# EAGLE design EscapeRoom_Shield_Mega_Master (EAGLE 9.6.2)
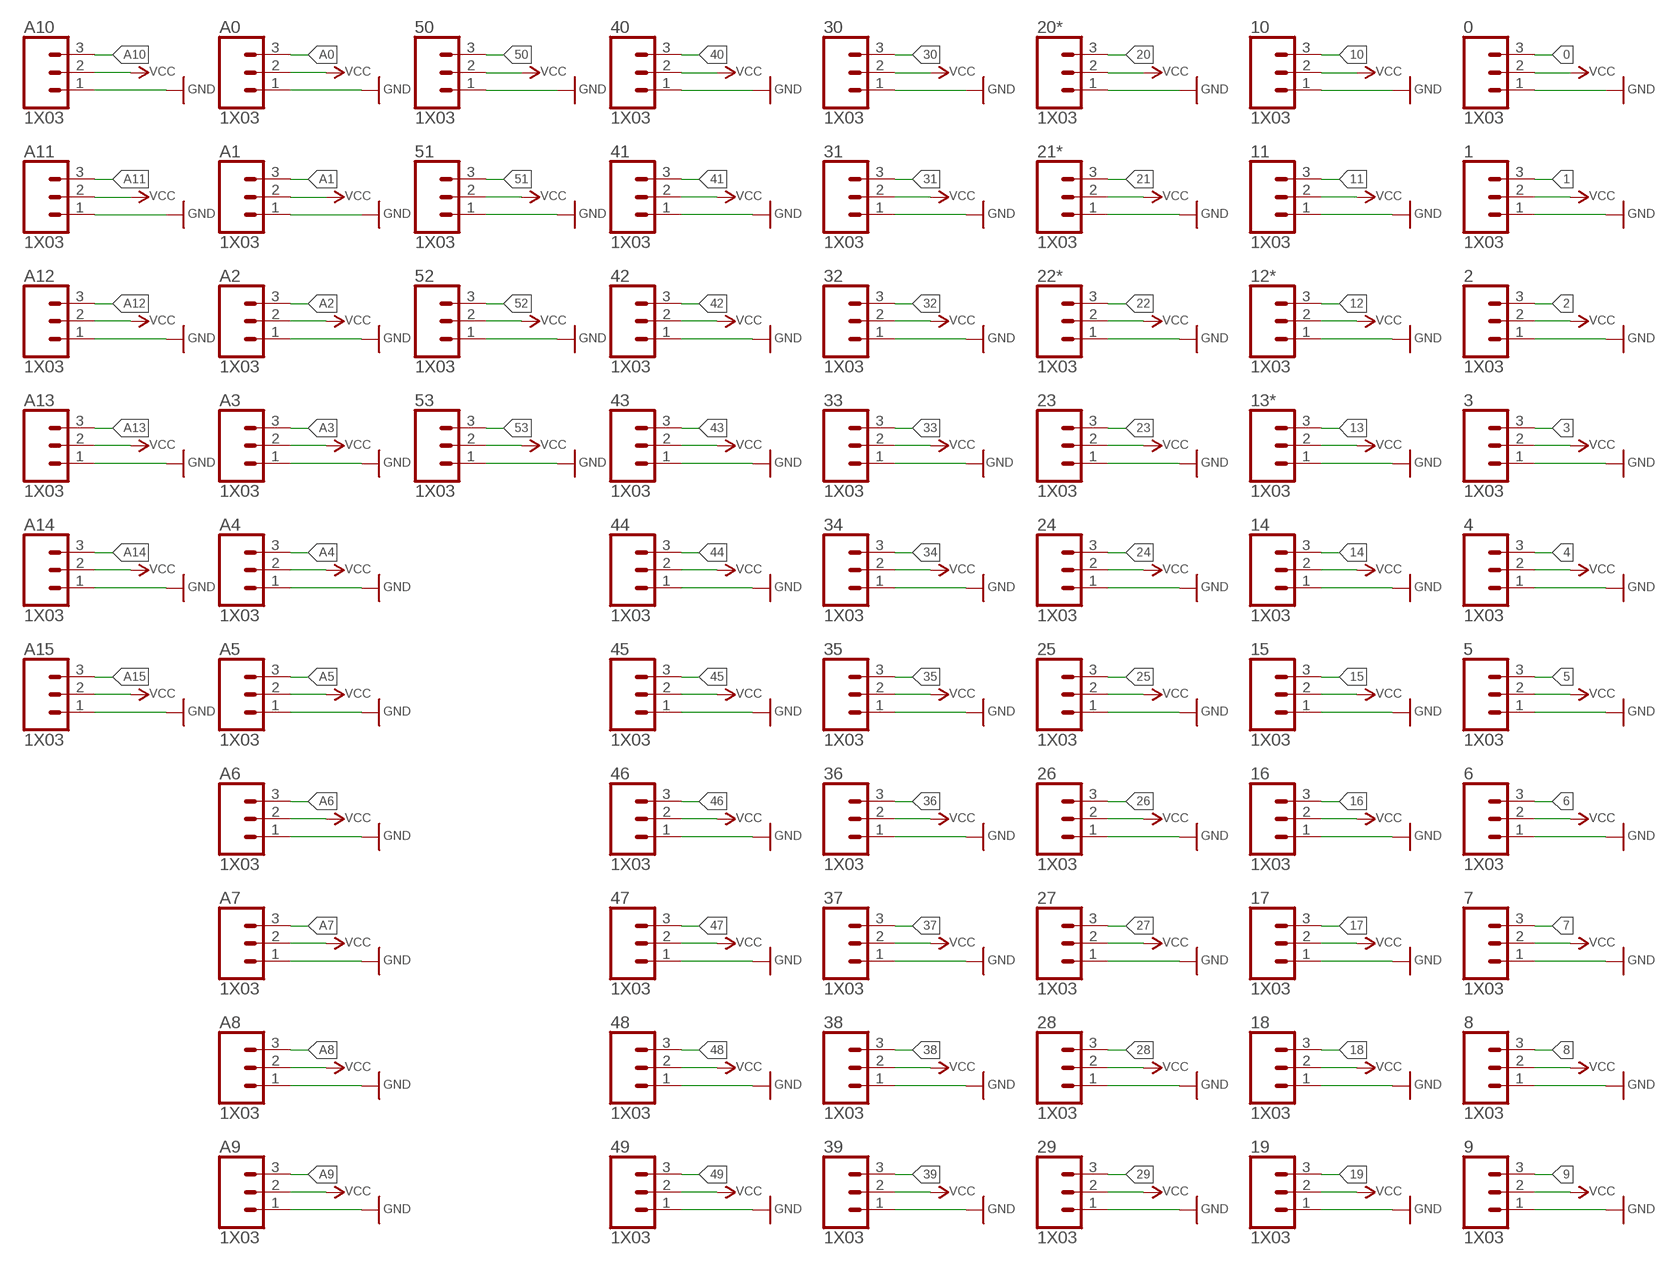
[diagram p0: schematic, sheet 1, part 1 of 2]
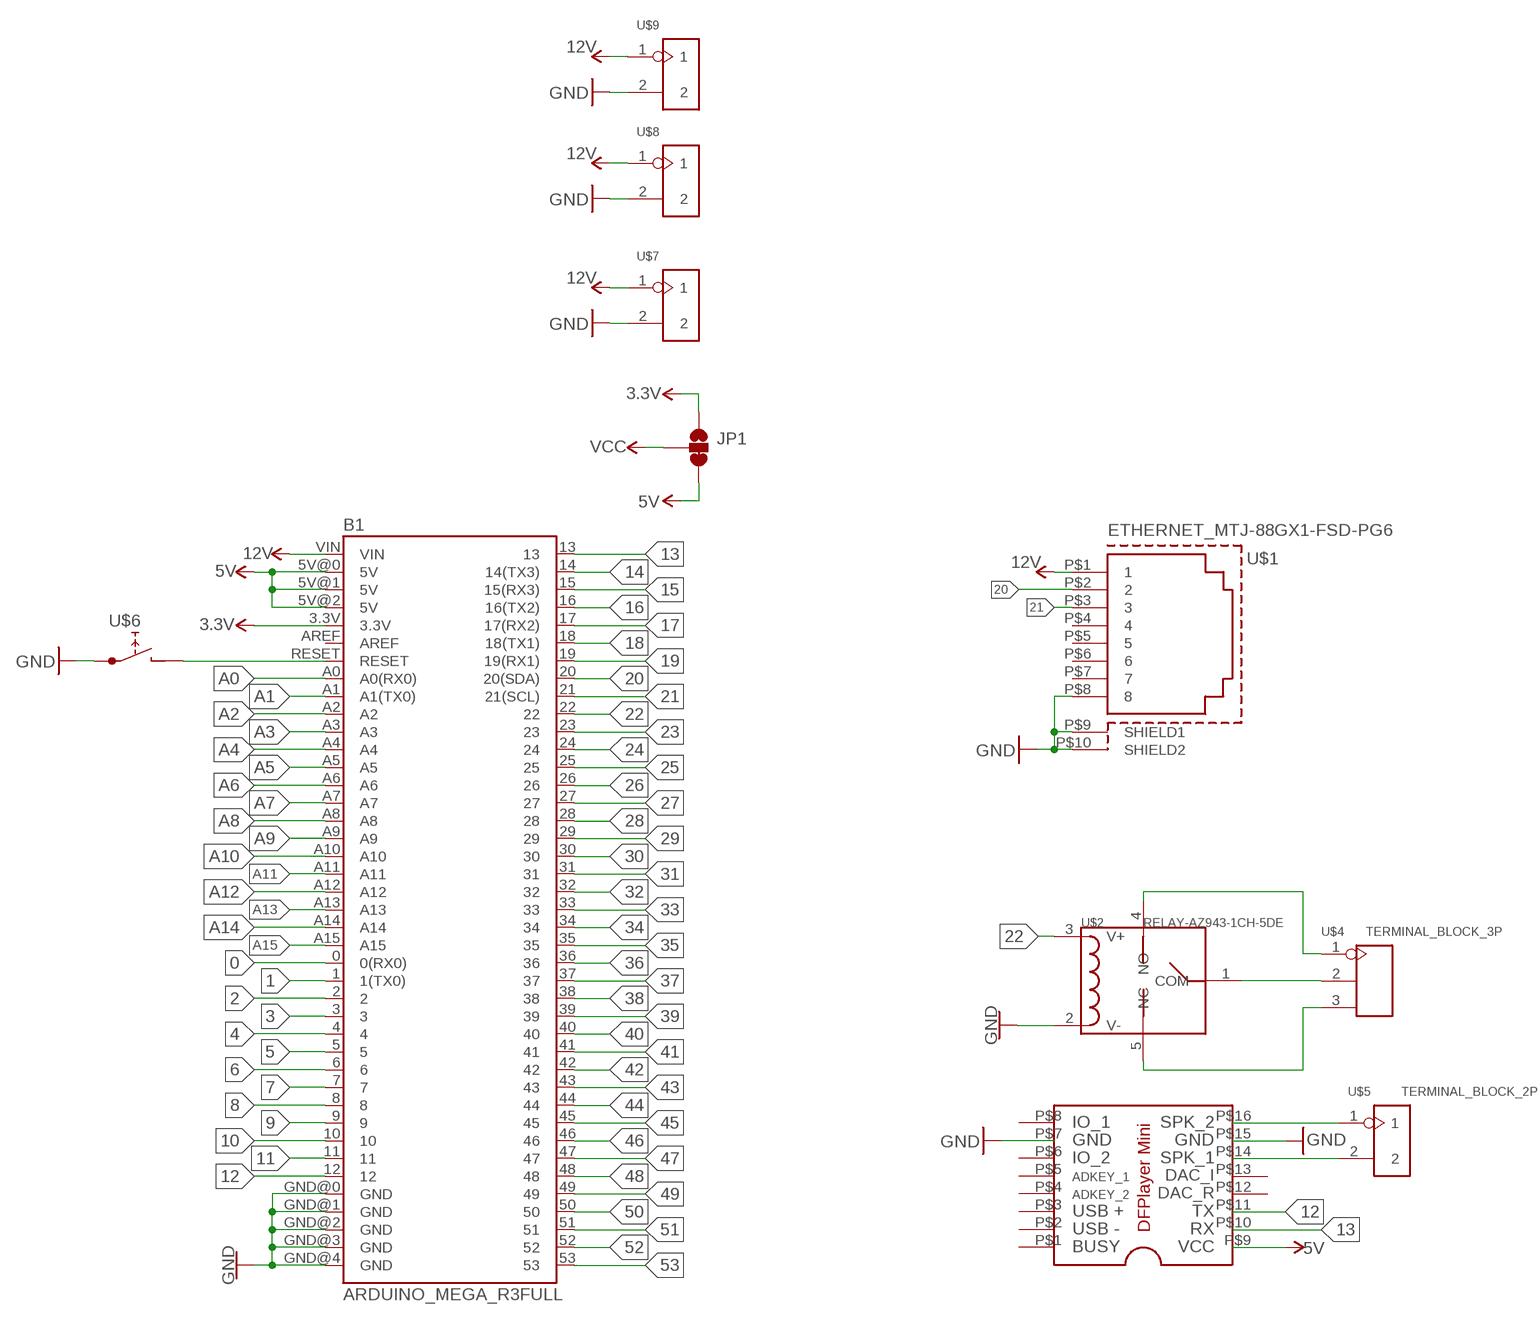
[diagram p1: schematic, sheet 1, part 2 of 2]

## Parts
0  1X03  [1X03]
1  1X03  [1X03]
2  1X03  [1X03]
3  1X03  [1X03]
4  1X03  [1X03]
5  1X03  [1X03]
6  1X03  [1X03]
7  1X03  [1X03]
8  1X03  [1X03]
9  1X03  [1X03]
10  1X03  [1X03]
11  1X03  [1X03]
12*  1X03  [1X03]
13*  1X03  [1X03]
14  1X03  [1X03]
15  1X03  [1X03]
16  1X03  [1X03]
17  1X03  [1X03]
18  1X03  [1X03]
19  1X03  [1X03]
20*  1X03  [1X03]
21*  1X03  [1X03]
22*  1X03  [1X03]
23  1X03  [1X03]
24  1X03  [1X03]
25  1X03  [1X03]
26  1X03  [1X03]
27  1X03  [1X03]
28  1X03  [1X03]
29  1X03  [1X03]
30  1X03  [1X03]
31  1X03  [1X03]
32  1X03  [1X03]
33  1X03  [1X03]
34  1X03  [1X03]
35  1X03  [1X03]
36  1X03  [1X03]
37  1X03  [1X03]
38  1X03  [1X03]
39  1X03  [1X03]
40  1X03  [1X03]
41  1X03  [1X03]
42  1X03  [1X03]
43  1X03  [1X03]
44  1X03  [1X03]
45  1X03  [1X03]
46  1X03  [1X03]
47  1X03  [1X03]
48  1X03  [1X03]
49  1X03  [1X03]
50  1X03  [1X03]
51  1X03  [1X03]
52  1X03  [1X03]
53  1X03  [1X03]
A0  1X03  [1X03]
A1  1X03  [1X03]
A2  1X03  [1X03]
A3  1X03  [1X03]
A4  1X03  [1X03]
A5  1X03  [1X03]
A6  1X03  [1X03]
A7  1X03  [1X03]
A8  1X03  [1X03]
A9  1X03  [1X03]
A10  1X03  [1X03]
A11  1X03  [1X03]
A12  1X03  [1X03]
A13  1X03  [1X03]
A14  1X03  [1X03]
A15  1X03  [1X03]
B1  ARDUINO_MEGA_R3FULL  [ARDUINO_MEGA]
JP1  JUMPER-SMT_3_1-NC_TRACE_SILK  [SMT-JUMPER_3_1-NC_TRACE_SILK]
U$1  ETHERNET_MTJ-88GX1-FSD-PG6  [RJ45_MTJ-88GX1-FSD-PG6]
U$2  RELAY-AZ943-1CH-5DE  [RELAY-19.0X15.0X15.0MM]
U$3  DFPLAYER_MINI  [DFMINI]
U$4  TERMINAL_BLOCK_3P  [H3-5.0-15.5X8.0MM]
U$5  TERMINAL_BLOCK_2P  [H2-5.0-10.5X8.0MM]
U$6  BUTTON_PTS636_SL50_LFS  [BUTTON_PTS636_SL50_LFS]
U$7  TERMINAL_BLOCK_2P  [H2-5.0-10.5X8.0MM]
U$8  TERMINAL_BLOCK_2P  [H2-5.0-10.5X8.0MM]
U$9  TERMINAL_BLOCK_2P  [H2-5.0-10.5X8.0MM]

## Nets
0: 0.3 B1.0(0(RX0))
1: 1.3 B1.1(1(TX0))
2: 2.3 B1.2
3: 3.3 B1.3
3.3V: B1.3.3V JP1.1
4: 4.3 B1.4
5: 5.3 B1.5
5V: B1.5V@0(5V) B1.5V@1(5V) B1.5V@2(5V) JP1.3 U$3.P$9
6: 6.3 B1.6
7: 7.3 B1.7
8: 8.3 B1.8
9: 9.3 B1.9
10: 10.3 B1.10
11: 11.3 B1.11
12: 12*.3 B1.12 U$3.P$11
12V: B1.VIN U$1.P$1 U$7.1 U$8.1 U$9.1
13: 13*.3 B1.13 U$3.P$10
14: 14.3 B1.14(14(TX3))
15: 15.3 B1.15(15(RX3))
16: 16.3 B1.16(16(TX2))
17: 17.3 B1.17(17(RX2))
18: 18.3 B1.18(18(TX1))
19: 19.3 B1.19(19(RX1))
20: 20*.3 B1.20(20(SDA)) U$1.P$2
21: 21*.3 B1.21(21(SCL)) U$1.P$3
22: 22*.3 B1.22 U$2.3(V+)
23: 23.3 B1.23
24: 24.3 B1.24
25: 25.3 B1.25
26: 26.3 B1.26
27: 27.3 B1.27
28: 28.3 B1.28
29: 29.3 B1.29
30: 30.3 B1.30
31: 31.3 B1.31
32: 32.3 B1.32
33: 33.3 B1.33
34: 34.3 B1.34
35: 35.3 B1.35
36: 36.3 B1.36
37: 37.3 B1.37
38: 38.3 B1.38
39: 39.3 B1.39
40: 40.3 B1.40
41: 41.3 B1.41
42: 42.3 B1.42
43: 43.3 B1.43
44: 44.3 B1.44
45: 45.3 B1.45
46: 46.3 B1.46
47: 47.3 B1.47
48: 48.3 B1.48
49: 49.3 B1.49
50: 50.3 B1.50
51: 51.3 B1.51
52: 52.3 B1.52
53: 53.3 B1.53
A0: A0.3 B1.A0(A0(RX0))
A1: A1.3 B1.A1(A1(TX0))
A2: A2.3 B1.A2
A3: A3.3 B1.A3
A4: A4.3 B1.A4
A5: A5.3 B1.A5
A6: A6.3 B1.A6
A7: A7.3 B1.A7
A8: A8.3 B1.A8
A9: A9.3 B1.A9
A10: A10.3 B1.A10
A11: A11.3 B1.A11
A12: A12.3 B1.A12
A13: A13.3 B1.A13
A14: A14.3 B1.A14
A15: A15.3 B1.A15
GND: 0.1 1.1 2.1 3.1 4.1 5.1 6.1 7.1 8.1 9.1 10.1 11.1 12*.1 13*.1 14.1 15.1 16.1 17.1 18.1 19.1 20*.1 21*.1 22*.1 23.1 24.1 25.1 26.1 27.1 28.1 29.1 30.1 31.1 32.1 33.1 34.1 35.1 36.1 37.1 38.1 39.1 40.1 41.1 42.1 43.1 44.1 45.1 46.1 47.1 48.1 49.1 50.1 51.1 52.1 53.1 A0.1 A1.1 A2.1 A3.1 A4.1 A5.1 A6.1 A7.1 A8.1 A9.1 A10.1 A11.1 A12.1 A13.1 A14.1 A15.1 B1.GND@0(GND) B1.GND@1(GND) B1.GND@2(GND) B1.GND@3(GND) B1.GND@4(GND) U$1.P$8 U$1.P$9(SHIELD1) U$1.P$10(SHIELD2) U$2.2(V-) U$3.P$7 U$3.P$15 U$6.P$1(A1) U$7.2 U$8.2 U$9.2
N$1: U$2.1(COM) U$4.2
N$2: U$2.4(NO) U$4.1
N$3: U$2.5(NC) U$4.3
N$5: U$3.P$16 U$5.1
N$6: U$3.P$14 U$5.2
N$7: B1.RESET U$6.P$2(B)
VCC: 0.2 1.2 2.2 3.2 4.2 5.2 6.2 7.2 8.2 9.2 10.2 11.2 12*.2 13*.2 14.2 15.2 16.2 17.2 18.2 19.2 20*.2 21*.2 22*.2 23.2 24.2 25.2 26.2 27.2 28.2 29.2 30.2 31.2 32.2 33.2 34.2 35.2 36.2 37.2 38.2 39.2 40.2 41.2 42.2 43.2 44.2 45.2 46.2 47.2 48.2 49.2 50.2 51.2 52.2 53.2 A0.2 A1.2 A2.2 A3.2 A4.2 A5.2 A6.2 A7.2 A8.2 A9.2 A10.2 A11.2 A12.2 A13.2 A14.2 A15.2 JP1.2
Unconnected: B1.AREF U$1.P$4 U$1.P$5 U$1.P$6 U$1.P$7 U$3.P$1 U$3.P$2 U$3.P$3 U$3.P$4 U$3.P$5 U$3.P$6 U$3.P$8 U$3.P$12 U$3.P$13

## Library data of the parts
0 1-11 12* 13* 14-19 20* 21* 22* 23-53 A0 A1-A15 = Adam's Parts (work):1X03
B1 = Adam's Parts (work):ARDUINO_MEGA_R3: Arduino Mega R3 ATmega2560 R3 compatible footprint. SparkFun Products: Arduino Mega 2560 R3 <https://www.sparkfun.com/products/11061>
JP1 = SparkFun-Jumpers:JUMPER-SMT_3_1-NC_TRACE: Normally closed trace jumper (1 of 2 connections) This jumper has a trace between two pads so it's normally closed (NC). The other connection is normally open (NO). Use a razor knife to open the connection. For best results follow the IPC guidelines for cutting traces: Cutout at least 0.063 mm (0.005 in). Remove all loose material to clean up the cut area. Seal the cut with an approved epoxy. Reapply solder to reclose the connection, or to close the NO connection.
U$1 = Adam's Parts (work):ETHERNET_MTJ-88GX1-FSD-PG6
U$2 = Adam's Parts (work):RELAY-AZ943-1CH-5DE
U$3 = Adam's Parts (work):DFPLAYER_MINI
U$4 = Adam's Parts (work):TERMINAL_BLOCK_3P
U$5 U$7-U$9 = Adam's Parts (work):TERMINAL_BLOCK_2P
U$6 = Adam's Parts (work):BUTTON_PTS636_SL50_LFS

## Board
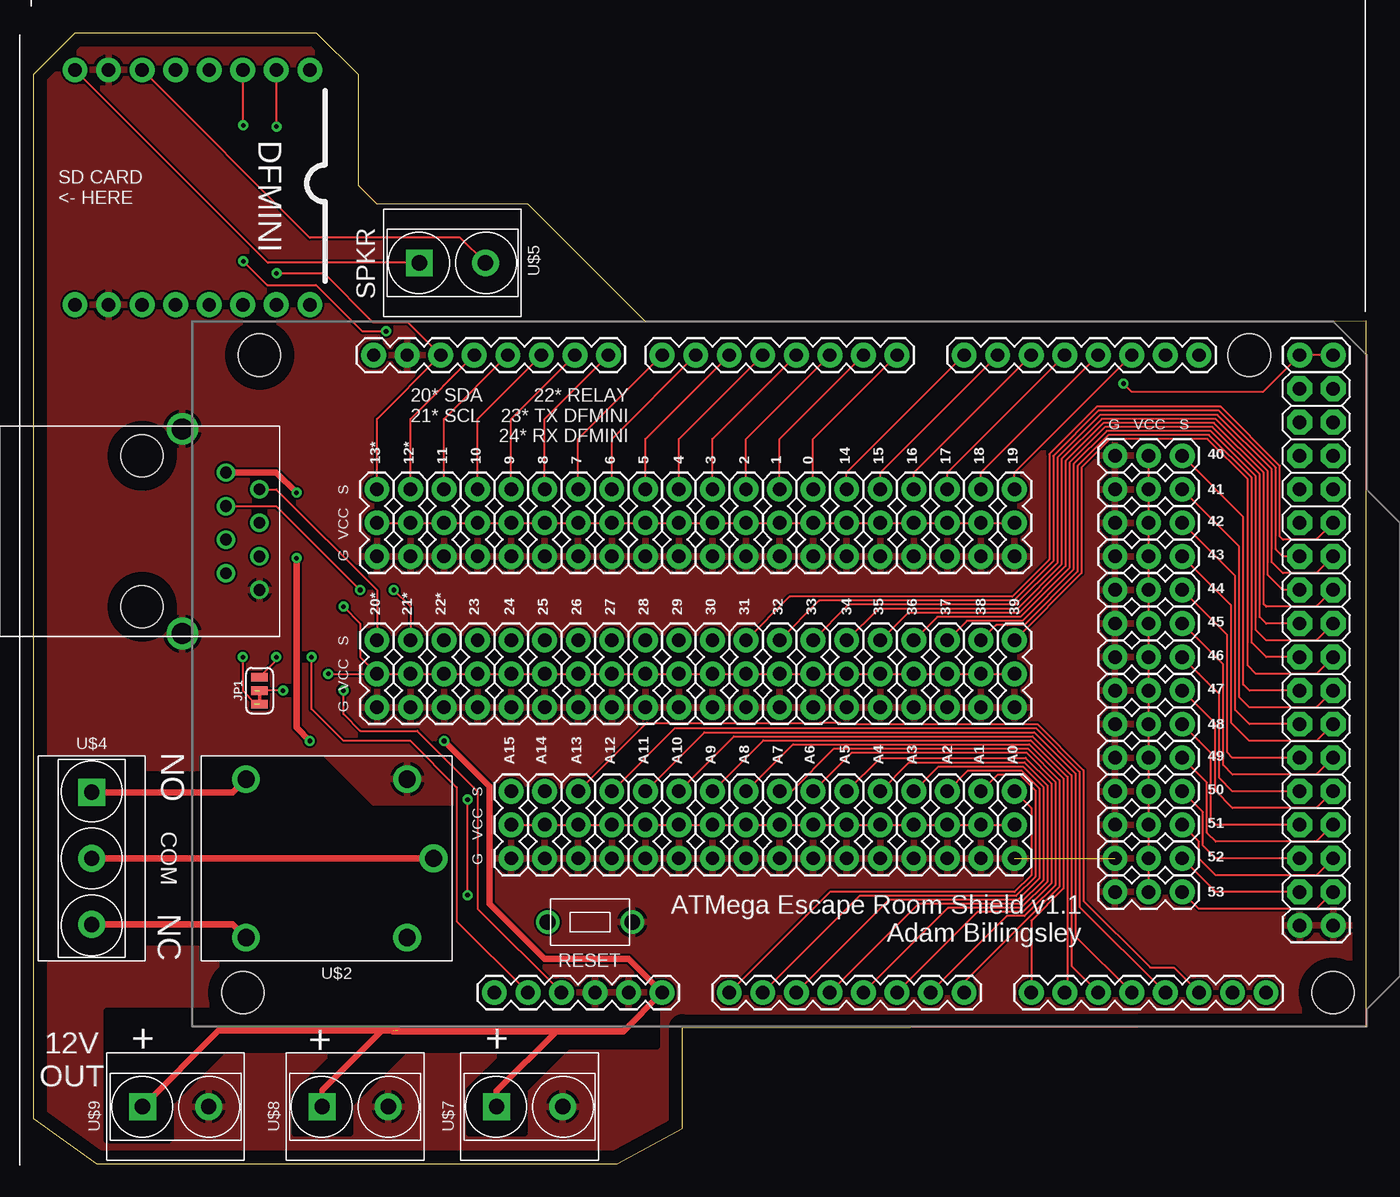
[diagram p2: board, top side]
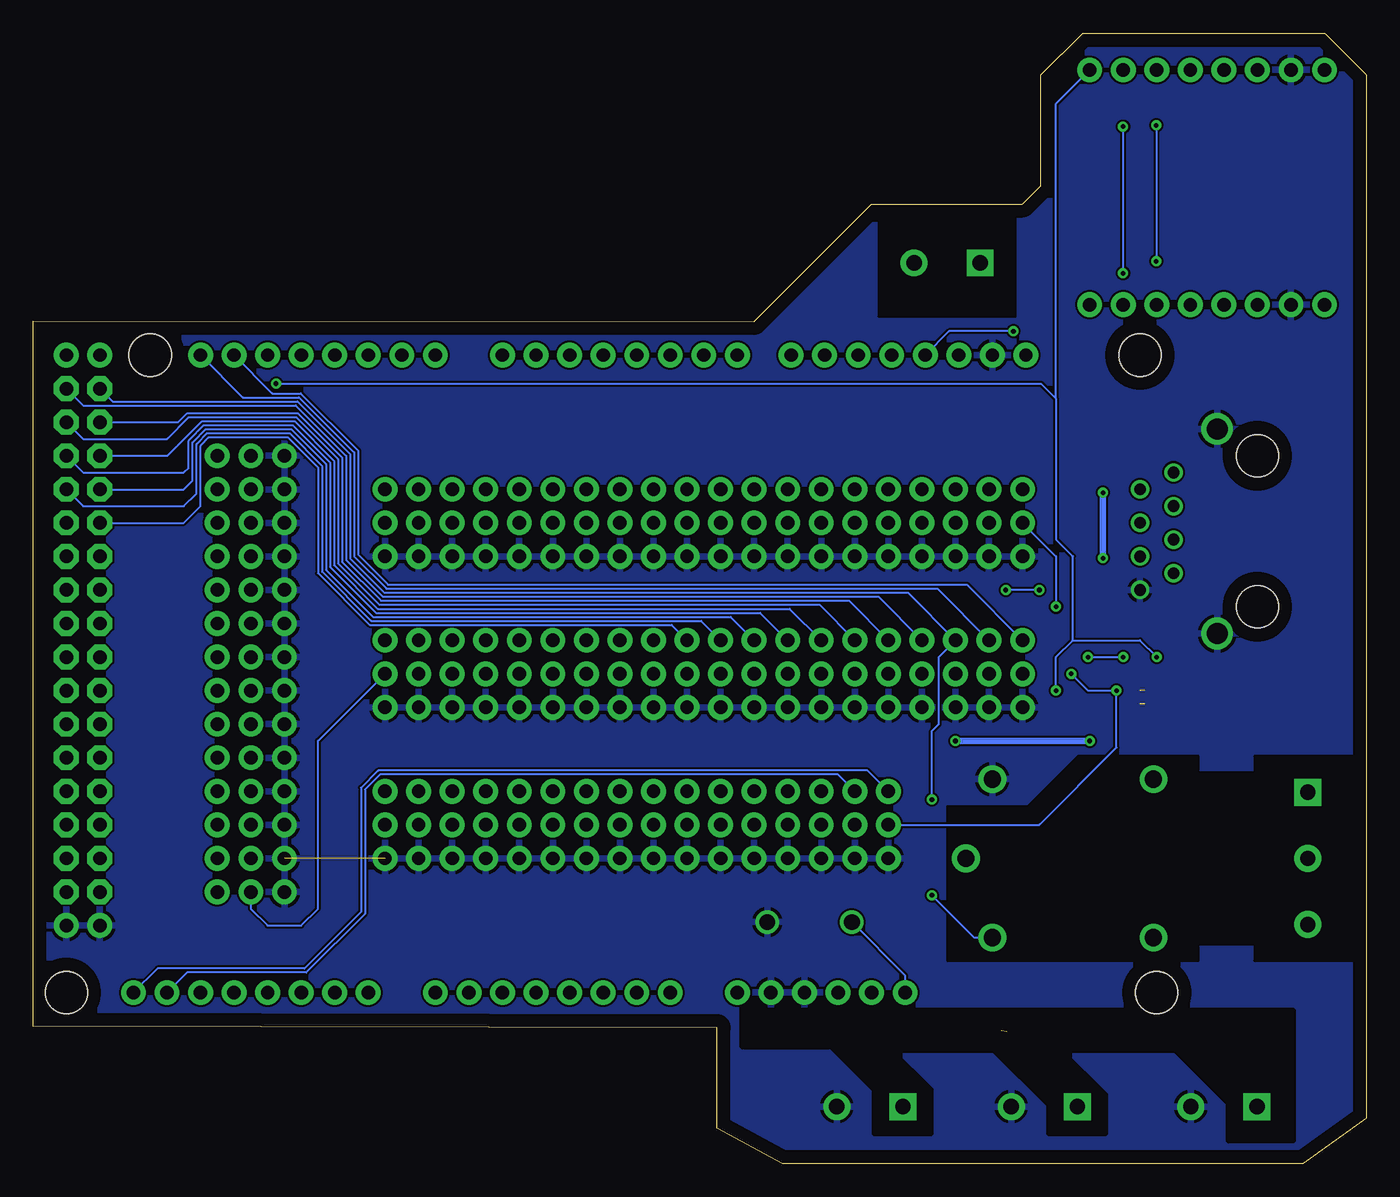
[diagram p3: board, bottom side, seen from below]

Size 100.95 x 85.6 mm. Coordinates in mm from the lower left corner, seen from the top.
Outline: 0,3.43 4.83,0 44.2,0 49.15,2.67 49.15,10.29 100.95,10.41 100.95,63.8 46.35,63.75 37.47,72.64 26.04,72.64 24.64,74.04 24.64,82.42 21.46,85.6 3.18,85.6 0,82.42 0,3.43
Copper layers (1*16): Top 0.035mm / dielectric 1.5mm / Bottom 0.035mm
Design rules "default": minimum track width 6mil, minimum drill 0.35mm, track to track 6mil, track to pad 6mil, pad to pad 6mil, via to via 6mil, smd to smd 6mil, copper to edge 40mil, drill to drill 6mil, minimum pad ring 10mil, minimum via ring 8mil, stop-mask expansion 4mil, vias tented up to drill 0mil, thermal gap 10mil

### Footprints (pad centres in the part's own frame; a part is rotated, then mirrored left to right if it is on the bottom)
1X03 = drill 1.016 pad 1.88: 1 0,0; 2 2.54,0; 3 5.08,0
ARDUINO_MEGA = drill 1.016 pad 1.88: 0 13.97,24.13; 1 11.43,24.13; 2 8.89,24.13; 3 6.35,24.13; 3.3V -13.97,-24.13; 4 3.81,24.13; 5 1.27,24.13; 5V@0 -11.43,-24.13; 5V@1 44.45,24.13; 5V@2 46.99,24.13; 6 -1.27,24.13; 7 -3.81,24.13; 8 -7.874,24.13; 9 -10.414,24.13; 10 -12.954,24.13; 11 -15.494,24.13; 12 -18.034,24.13; 13 -20.574,24.13; 14 19.05,24.13; 15 21.59,24.13; 16 24.13,24.13; 17 26.67,24.13; 18 29.21,24.13; 19 31.75,24.13; 20 34.29,24.13; 21 36.83,24.13; A0 1.27,-24.13; A1 3.81,-24.13; A2 6.35,-24.13; A3 8.89,-24.13; A4 11.43,-24.13; A5 13.97,-24.13; A6 16.51,-24.13; A7 19.05,-24.13; A8 24.13,-24.13; A9 26.67,-24.13; A10 29.21,-24.13; A11 31.75,-24.13; A12 34.29,-24.13; A13 36.83,-24.13; A14 39.37,-24.13; A15 41.91,-24.13; AREF -25.654,24.13; GND@0 -8.89,-24.13; GND@1 -6.35,-24.13; GND@2 44.45,-19.05; GND@3 46.99,-19.05; GND@4 -23.114,24.13; RESET -16.51,-24.13; VIN -3.81,-24.13 | drill 1.016 pad 1.88 octagon: 22 44.45,21.59; 23 46.99,21.59; 24 44.45,19.05; 25 46.99,19.05; 26 44.45,16.51; 27 46.99,16.51; 28 44.45,13.97; 29 46.99,13.97; 30 44.45,11.43; 31 46.99,11.43; 32 44.45,8.89; 33 46.99,8.89; 34 44.45,6.35; 35 46.99,6.35; 36 44.45,3.81; 37 46.99,3.81; 38 44.45,1.27; 39 46.99,1.27; 40 44.45,-1.27; 41 46.99,-1.27; 42 44.45,-3.81; 43 46.99,-3.81; 44 44.45,-6.35; 45 46.99,-6.35; 46 44.45,-8.89; 47 46.99,-8.89; 48 44.45,-11.43; 49 46.99,-11.43; 50 44.45,-13.97; 51 46.99,-13.97; 52 44.45,-16.51; 53 46.99,-16.51 | hole 3.2: -34.29,24.13; -35.56,-24.13; 40.64,24.13; 46.99,-24.13
SMT-JUMPER_3_1-NC_TRACE_SILK = smd 0.635 x 1.27: 1 -1.016,0; 2 0,0; 3 1.016,0
RJ45_MTJ-88GX1-FSD-PG6 = drill 0.889: P$1 1.27,6.35; P$2 2.54,8.89; P$3 3.81,6.35; P$4 5.08,8.89; P$5 6.35,6.35; P$6 7.62,8.89; P$7 8.89,6.35; P$8 10.16,8.89 | drill 1.6: P$9 -2.032,3.048; P$10 13.462,3.048 | hole 3.2: 0,0; 11.43,0
RELAY-19.0X15.0X15.0MM = drill 1.3 pad 2.1: 1 -8.1,0; 2 -6.1,-6; 3 -6.1,6; 4 6.1,-6; 5 6.1,6
DFMINI = drill 1.016 pad 1.88: P$1 0,2.54; P$2 0,0; P$3 0,5.08; P$4 0,7.62; P$5 0,10.16; P$6 0,12.7; P$7 0,15.24; P$8 0,17.78; P$9 17.78,0; P$10 17.78,2.54; P$11 17.78,5.08; P$12 17.78,7.62; P$13 17.78,10.16; P$14 17.78,12.7; P$15 17.78,15.24; P$16 17.78,17.78
H3-5.0-15.5X8.0MM = drill 1.168 pad 2.032 square: 1 0,5 | drill 1.168 pad 2.032: 2 0,0; 3 0,-5
H2-5.0-10.5X8.0MM = drill 1.168 pad 2.032 square: 1 0,2.5 | drill 1.168 pad 2.032: 2 0,-2.5
BUTTON_PTS636_SL50_LFS = drill 1.2: P$1 -3.2,0; P$2 3.2,0

### Placement (x,y rotation side)
0  59.05,45.97 90 top
1  56.52,45.97 90 top
2  53.98,45.97 90 top
3  51.43,45.97 90 top
4  48.89,45.97 90 top
5  46.35,45.97 90 top
6  43.81,45.97 90 top
7  41.27,45.97 90 top
8  38.73,45.97 90 top
9  36.2,45.97 90 top
10  33.66,45.97 90 top
11  31.12,45.97 90 top
12*  28.58,45.97 90 top
13*  26.04,45.97 90 top
14  61.59,45.97 90 top
15  64.14,45.97 90 top
16  66.67,45.97 90 top
17  69.22,45.97 90 top
18  71.75,45.97 90 top
19  74.3,45.97 90 top
20*  26.04,34.54 90 top
21*  28.58,34.54 90 top
22*  31.12,34.54 90 top
23  33.66,34.54 90 top
24  36.2,34.54 90 top
25  38.73,34.54 90 top
26  41.27,34.54 90 top
27  43.81,34.54 90 top
28  46.35,34.54 90 top
29  48.89,34.54 90 top
30  51.43,34.54 90 top
31  53.98,34.54 90 top
32  56.52,34.54 90 top
33  59.05,34.54 90 top
34  61.59,34.54 90 top
35  64.14,34.54 90 top
36  66.67,34.54 90 top
37  69.22,34.54 90 top
38  71.75,34.54 90 top
39  74.3,34.54 90 top
40  81.92,53.59 0 top
41  81.92,51.05 0 top
42  81.92,48.51 0 top
43  81.92,45.97 0 top
44  81.92,43.43 0 top
45  81.92,40.89 0 top
46  81.92,38.35 0 top
47  81.92,35.81 0 top
48  81.92,33.27 0 top
49  81.92,30.73 0 top
50  81.92,28.19 0 top
51  81.92,25.65 0 top
52  81.92,23.11 0 top
53  81.92,20.57 0 top
A0  74.3,23.11 90 top
A1  71.75,23.11 90 top
A2  69.22,23.11 90 top
A3  66.67,23.11 90 top
A4  64.14,23.11 90 top
A5  61.59,23.11 90 top
A6  59.05,23.11 90 top
A7  56.52,23.11 90 top
A8  53.98,23.11 90 top
A9  51.43,23.11 90 top
A10  48.89,23.11 90 top
A11  46.35,23.11 90 top
A12  43.81,23.11 90 top
A13  41.27,23.11 90 top
A14  38.73,23.11 90 top
A15  36.2,23.11 90 top
B1  51.43,37.08 0 top
JP1  17.14,35.81 270 top
U$1  8.26,53.59 270 top
U$2  22.23,23.11 180 top
U$3  20.95,65.02 90 top
U$4  4.45,23.11 0 top
U$5  31.75,68.2 90 top
U$6  42.16,18.29 180 top
U$7  37.59,4.32 90 top
U$8  24.38,4.32 90 top
U$9  10.79,4.32 90 top

### Tracks (layer width: path | path; a pad name or v marks a point on that pad's centre or on a via)
0
  Top 0.152: 0.3 59.05,54.86 B1.0
1
  Top 0.152: 1.3 56.52,54.86 B1.1
2
  Top 0.152: 2.3 53.98,54.86 B1.2
3
  Top 0.152: 3.3 51.43,54.86 B1.3
3.3V  (via drill 0.35)
  Top 0.152: B1.3.3V 32.08,18.34 32.08,28.5 28.58,32 23.5,32 21.08,34.42 v21.08,38.35 | v18.41,38.35 18.41,38.1 JP1.1
  Bottom 0.152: v21.08,38.35 v18.41,38.35
4
  Top 0.152: 4.3 48.89,54.86 B1.4
5
  Top 0.152: 5.3 46.35,54.86 B1.5
5V  (via drill 0.35)  (1 unrouted)
  Top 0.152: B1.5V@0 33.66,19.3 33.66,28.19 29.08,32.77 24.77,32.77 23.5,34.04 v23.5,35.81 | B1.5V@2 B1.5V@1 93.09,58.42 83.19,58.42 v82.55,59.05 | 16.79,34.8 16.79,34.89 15.88,35.81 v15.88,38.35
  Bottom 0.152: v23.5,35.81 23.5,38.35 22.23,39.62 | 23.5,57.91 23.5,47.24 22.23,45.97 22.23,39.62 | v82.55,59.05 24.64,59.05 23.5,57.91 | U$3.P$9 23.5,80.26 23.5,57.91 | v15.88,38.35 17.14,39.62 22.23,39.62
6
  Top 0.152: 6.3 43.81,54.86 B1.6
7
  Top 0.152: 7.3 41.27,54.86 B1.7
8
  Top 0.152: 8.3 38.73,56.39 B1.8
9
  Top 0.152: 9.3 36.2,56.39 B1.9
10
  Top 0.152: 10.3 33.66,56.39 B1.10
11
  Top 0.152: 11.3 31.12,56.39 B1.11
12  (via drill 0.35)
  Top 0.152: 12*.3 28.58,56.39 B1.12 | U$3.P$11 15.88,78.66 v15.93,78.61 | v15.93,68.31 17.73,66.51 21.43,66.51 24.93,63.01 v26.73,63.01 26.83,63.01
  Bottom 0.152: v15.93,78.61 v15.93,68.31 | v26.73,63.01 31.6,63.01 B1.12
12V  (via drill 0.35)  (1 unrouted)
  Top 0.406: U$8.1 21.88,5.54 26.42,10.08
  Top 0.508: v31.12,32 34.54,28.58 34.54,19.69 38.73,15.49 45.09,15.49 B1.VIN 44.7,10.03 39.62,10.03 | v20.95,32 19.94,33.02 v19.94,45.85 | v19.94,50.8 18.41,52.32 U$1.P$1 | 39.62,10.03 35.09,5.5 U$7.1 | 39.62,10.03 27.22,10.03 | 27.65,10.08 26.42,10.08 14.06,10.08 U$9.1
  Bottom 0.508: v31.12,32 v20.95,32 | v19.94,50.8 v19.94,45.85
13  (via drill 0.35)
  Top 0.152: 13*.3 26.04,56.39 B1.13 28.36,63.71 25.73,63.71 22.02,67.41 v18.43,67.41 | 18.3,82.68 U$3.P$10 v18.41,78.52 v18.43,78.51
  Bottom 0.152: v18.43,78.51 v18.43,67.41
14
  Top 0.152: 14.3 61.59,52.32 B1.14
15
  Top 0.152: 15.3 64.14,52.32 B1.15
16
  Top 0.152: 16.3 66.67,52.32 B1.16
17
  Top 0.152: 17.3 69.22,52.32 B1.17
18
  Top 0.152: 18.3 71.75,52.32 B1.18
19
  Top 0.152: 19.3 74.3,52.32 B1.19
20
  Top 0.152: U$1.P$2 18.41,51.05 26.04,43.43 20*.3
  Bottom 0.152: B1.20 82.83,58.32 80.68,58.32 76.33,53.97 76.33,46.1 74.07,43.84 30.25,43.84 20*.3
21  (via drill 0.35)
  Top 0.152: U$1.P$3 18.41,49.78 v24.77,43.43 | v27.3,43.43 28.58,42.16 21*.3
  Bottom 0.152: B1.21 85.07,58.01 80.8,58.01 76.63,53.84 76.63,45.97 74.19,43.54 32.49,43.54 21*.3 | v24.77,43.43 v27.3,43.43
22  (via drill 0.35)
  Top 0.152: v32.89,20.32 v32.89,27.56
  Bottom 0.152: B1.22 94.92,57.71 80.93,57.71 76.94,53.72 76.94,45.82 74.35,43.23 34.72,43.23 22*.3 32.38,38.35 32.38,33.27 32.89,32.77 v32.89,27.56 | U$2.3 29.69,17.11 v32.89,20.32
23
  Bottom 0.152: B1.23 97.16,57.4 81.06,57.4 77.24,53.59 77.24,45.69 74.48,42.93 36.96,42.93 23.3
24
  Bottom 0.152: 24.3 39.19,42.62 74.6,42.62 77.55,45.57 77.55,53.46 80.9,56.82 89.28,56.82 89.97,56.13 B1.24
25
  Bottom 0.152: B1.25 97.16,54.86 90.81,54.86 89.15,56.52 81.03,56.52 77.85,53.34 77.85,45.44 74.73,42.32 41.43,42.32 25.3
26
  Bottom 0.152: 26.3 43.66,42.01 74.86,42.01 78.16,45.31 78.16,53.21 81.16,56.21 88.14,56.21 90.75,53.59 B1.26
27
  Bottom 0.152: B1.27 97.16,52.32 89.54,52.32 89.18,52.68 89.18,54.73 88.01,55.91 81.28,55.91 78.46,53.09 78.46,45.19 74.98,41.71 45.9,41.71 27.3
28
  Bottom 0.152: B1.28 89.54,51.05 88.88,51.71 88.88,54.61 87.88,55.6 81.41,55.6 78.77,52.96 78.77,44.96 75.21,41.4 48.13,41.4 28.3
29
  Bottom 0.152: B1.29 97.16,49.78 89.54,49.78 88.57,50.75 88.57,54.48 87.76,55.3 81.53,55.3 79.07,52.83 79.07,44.83 75.34,41.1 50.37,41.1 29.3
30
  Bottom 0.152: B1.30 89.54,48.51 88.27,49.78 88.27,54.36 87.63,54.99 81.66,54.99 79.38,52.71 79.38,44.7 75.46,40.79 52.6,40.79 30.3
31
  Top 0.152: B1.31 97.16,47.24 94.62,47.24 94.39,47.47 94.39,52.83 89.91,57.3 80.52,57.3 76.94,53.72 76.94,45.74 74.12,42.93 57.28,42.93 31.3
32
  Top 0.152: B1.32 94.62,45.97 94.08,46.51 94.08,52.7 89.78,57 80.65,57 77.24,53.59 77.24,45.62 74.25,42.62 59.51,42.62 32.3
33
  Top 0.152: B1.33 97.16,44.7 94.62,44.7 93.78,45.54 93.78,52.57 89.66,56.69 80.78,56.69 77.55,53.46 77.55,45.49 74.37,42.32 61.75,42.32 33.3
34
  Top 0.152: B1.34 94.62,43.43 93.47,44.58 93.47,52.45 89.53,56.39 80.9,56.39 77.85,53.34 77.85,45.36 74.5,42.01 63.98,42.01 34.3
35
  Top 0.152: B1.35 97.16,42.16 93.34,42.16 93.17,42.34 93.17,52.32 89.41,56.08 81.03,56.08 78.16,53.21 78.16,45.24 74.63,41.71 66.22,41.71 35.3
36
  Top 0.152: B1.36 93.34,40.89 92.86,41.38 92.86,52.2 89.28,55.78 81.15,55.78 78.46,53.09 78.46,45.11 74.75,41.4 68.45,41.4 36.3
37
  Top 0.152: B1.37 97.16,39.62 93.34,39.62 92.56,40.41 92.56,52.07 89.15,55.47 81.28,55.47 78.77,52.96 78.77,44.98 74.88,41.1 70.69,41.1 37.3
38
  Top 0.152: B1.38 93.34,38.35 92.25,39.45 92.25,51.94 89.03,55.17 81.41,55.17 79.07,52.83 79.07,44.83 75.03,40.79 73.81,40.79 73.79,40.77 72.9,40.77 38.3
39
  Top 0.152: B1.39 97.16,37.08 92.58,37.08 91.95,37.72 91.95,51.82 88.9,54.86 81.53,54.86 79.38,52.71 79.38,44.7 39.3
40
  Top 0.152: 40.3 91.62,48.97 91.62,40.39 91.62,40.08 91.62,36.27 92.08,35.81 B1.40
41
  Top 0.152: B1.41 97.16,34.54 92.08,34.54 91.31,35.31 91.31,46.74 41.3
42
  Top 0.152: B1.42 92.08,33.27 91.01,34.34 91.01,44.5 42.3
43
  Top 0.152: B1.43 97.16,32 92.08,32 90.7,33.38 90.7,42.27 43.3
44
  Top 0.152: B1.44 90.81,30.73 90.4,31.14 90.4,40.03 44.3
45
  Top 0.152: B1.45 97.16,29.46 90.81,29.46 90.09,30.17 90.09,37.8 45.3
46
  Top 0.152: 46.3 88.27,37.08 88.88,36.47 89.79,35.56 89.79,29.21 90.81,28.19 B1.46
47
  Top 0.152: B1.47 97.16,26.92 90.81,26.92 89.48,28.24 89.48,33.33 47.3
48
  Top 0.152: 48.3 88.27,32 88.57,31.7 89.18,31.09 89.18,26.01 89.54,25.65 B1.48
49
  Top 0.152: B1.49 97.16,24.38 89.54,24.38 88.88,25.04 88.88,28.85 49.3
50
  Top 0.152: B1.50 89.54,23.11 88.57,24.08 88.57,26.62 50.3
51
  Top 0.152: B1.51 97.16,21.84 89.54,21.84 88.27,23.11 88.27,24.38 51.3
52
  Top 0.152: B1.52 89.54,20.57 52.3
53
  Top 0.152: B1.53 97.16,19.3 88.27,19.3 53.3
A0
  Top 0.152: A0.3 75.57,26.92 75.57,21.84 74.3,20.57 60.32,20.57 B1.A0
A1
  Top 0.152: A1.3 73.03,29.46 74.68,29.46 75.87,28.27 75.87,21.72 74.42,20.27 62.56,20.27 B1.A1
A2
  Top 0.152: A2.3 70.79,29.77 74.8,29.77 76.18,28.4 76.18,21.59 74.55,19.96 64.8,19.96 B1.A2
A3
  Top 0.152: A3.3 68.56,30.07 74.93,30.07 76.48,28.52 76.48,21.46 74.67,19.66 67.03,19.66 B1.A3
A4
  Top 0.152: A4.3 66.32,30.38 75.06,30.38 76.78,28.65 76.78,21.34 74.8,19.36 69.27,19.36 B1.A4
A5
  Top 0.152: A5.3 64.14,30.73 75.13,30.73 77.09,28.78 77.09,21.21 74.93,19.05 71.5,19.05 B1.A5
A6
  Top 0.152: A6.3 61.98,31.12 75.18,31.12 77.39,28.9 77.39,21.09 75.59,19.28 75.05,18.74 73.74,18.74 B1.A6
A7
  Top 0.152: A7.3 57.4,28.19 60.63,31.42 75.31,31.42 77.7,29.03 77.7,20.96 70.48,13.75 B1.A7
A8
  Top 0.152: A8.3 57.53,31.75 75.41,31.75 78,29.16 78,20.83 75.57,18.4 B1.A8
A9
  Top 0.152: A9.3 55.3,32.05 75.54,32.05 78.31,29.28 78.31,13.16 B1.A9
A10
  Top 0.152: A10.3 53.06,32.36 75.66,32.36 78.61,29.41 78.61,14.99 B1.A10
A11
  Top 0.152: A11.3 50.82,32.66 75.79,32.66 78.92,29.53 78.92,17.22 B1.A11
A12
  Top 0.152: A12.3 48.59,32.97 75.91,32.97 79.22,29.66 79.22,19.46 B1.A12
A13
  Top 0.152: A13.3 46.46,33.38 59.54,33.38 59.56,33.4 61.09,33.4 61.21,33.27 76.04,33.27 79.53,29.79 79.53,19.91 84.58,14.86 86.36,14.86 B1.A13
A14
  Bottom 0.152: A14.3 40.01,29.46 74.68,29.46 75.46,28.68 75.82,28.32 75.82,18.92 80.26,14.48 89.28,14.48 B1.A14
A15
  Bottom 0.152: A15.3 37.77,29.77 74.8,29.77 76.12,28.45 76.12,19.05 80.39,14.78 91.52,14.78 B1.A15
GND  (1 unrouted)
  pour Top (rank 2): 0,3.43 0,82.17 3.43,85.6 21.46,85.6 24.64,82.42 24.64,74.04 26.04,72.64 37.47,72.64 46.35,63.75 100.97,63.75 100.97,10.41 49.15,10.41 49.15,2.41 46.74,0 3.43,0
  pour Bottom: 0,3.56 0,82.3 3.3,85.6 21.46,85.6 24.64,82.42 24.64,74.17 26.16,72.64 37.47,72.64 46.35,63.75 100.97,63.75 100.97,10.29 49.15,10.29 49.15,2.67 46.74,0.25 3.43,0.25 0.13,3.56
N$1
  Top 0.508: U$2.1 U$4.2
N$2
  Top 0.152: 4.53,28.19 U$4.1
  Top 0.508: U$4.1 15.12,28.11 U$2.4
N$3
  Top 0.508: U$2.5 15.12,18.11 U$4.3
N$5
  Top 0.152: U$5.1 17.78,68.2 U$3.P$16
N$6
  Top 0.152: U$5.2 32.34,70.1 20.95,70.1 U$3.P$14
N$7
  Bottom 0.152: U$6.P$2 34.92,14.25 B1.RESET
NOGND
  cutout Top: 5.59,1.78 5.59,11.56 47.24,11.56 47.24,8.89 40.51,8.89 37.21,5.59 37.21,3.56 37.21,2.29 33.02,2.29 33.02,5.59 36.07,8.64 28.19,8.64 24,4.44 24,2.29 19.81,2.29 19.81,5.21 23.24,8.64 14.48,8.64 10.41,4.57 10.41,2.41 10.41,1.9 10.29,1.78
  cutout Bottom: 5.59,1.78 5.59,11.56 47.24,11.56 47.24,8.89 40.51,8.89 37.21,5.59 37.21,2.29 33.02,2.29 33.02,5.59 36.07,8.64 28.19,8.64 24,4.44 24,2.29 19.81,2.29 19.81,5.21 23.24,8.64 14.48,8.64 10.41,4.57 10.41,1.78
  cutout Bottom: 8.26,29.46 13.34,29.46 13.34,16.76 8.26,16.76
  cutout Top: 8.26,29.46 13.34,29.46 13.34,16.76 8.26,16.76
NOGND1
  cutout Top: 26.54,64.13 26.54,72.14 26.67,72.26 36.96,72.26 36.96,64.13
  cutout Bottom: 26.54,64.13 26.54,72.26 36.96,72.26 36.96,64.13
NOGND2
  cutout Top: 12.7,15.37 12.7,30.86 21.84,30.86 25.65,27.05 31.75,27.05 31.75,15.37
  cutout Bottom: 12.7,15.37 12.7,30.86 21.84,30.86 25.65,27.05 31.75,27.05 31.75,15.37
NOGND3
  cutout Top: 0.38,30.86 8.51,30.86 8.51,15.37 0.38,15.37
  cutout Bottom: 0.38,15.37 0.38,30.86 8.51,30.86 8.51,15.37
VCC  (via drill 0.35)  (1 unrouted)
  Top 0.152: 20*.2 21*.2 22*.2 23.2 24.2 25.2 26.2 27.2 28.2 29.2 30.2 31.2 32.2 33.2 34.2 35.2 36.2 37.2 38.2 39.2 | 53.2 52.2 51.2 50.2 49.2 48.2 47.2 46.2 45.2 44.2 43.2 42.2 41.2 40.2 | v22.35,37.08 20*.2 | A15.2 A14.2 A13.2 A12.2 A11.2 A10.2 A9.2 A8.2 A7.2 A6.2 A5.2 A4.2 A3.2 A2.2 A1.2 A0.2 | 13*.2 12*.2 11.2 10.2 9.2 8.2 7.2 6.2 5.2 4.2 3.2 2.2 1.2 0.2 14.2 15.2 16.2 17.2 18.2 19.2 | v23.5,42.16 24.77,40.89 24.77,38.35 20*.2 | v18.92,35.81 16.79,35.81
  Bottom 0.152: 13*.2 23.5,45.97 v23.5,42.16 | A15.2 24.77,25.65 18.92,31.5 v18.92,35.81 21.08,35.81 v22.35,37.08 | 53.2 84.46,19.3 83.19,18.03 80.65,18.03 79.38,19.3 79.38,32 39.2

### Text on the board
tPlace: DFMINI | SD CARD / <- HERE | SPKR | 20* SDA / 21* SCL | 22* RELAY / 23* TX DFMINI / 24* RX DFMINI | NO | COM | NC | ATMega Escape Room Shield v1.1 / Adam Billingsley | RESET | 12V / OUT | + | + | +
tNames: G | VCC | S | S | VCC | G | S | VCC | G | S | VCC | G